# Altium schematic sheet Microcontroller.SchDoc
size D; DrawnBy: Ross Harvey; Engineer: Ross Harvey; Revision: A; SheetNumber: 3; SheetTotal: 7
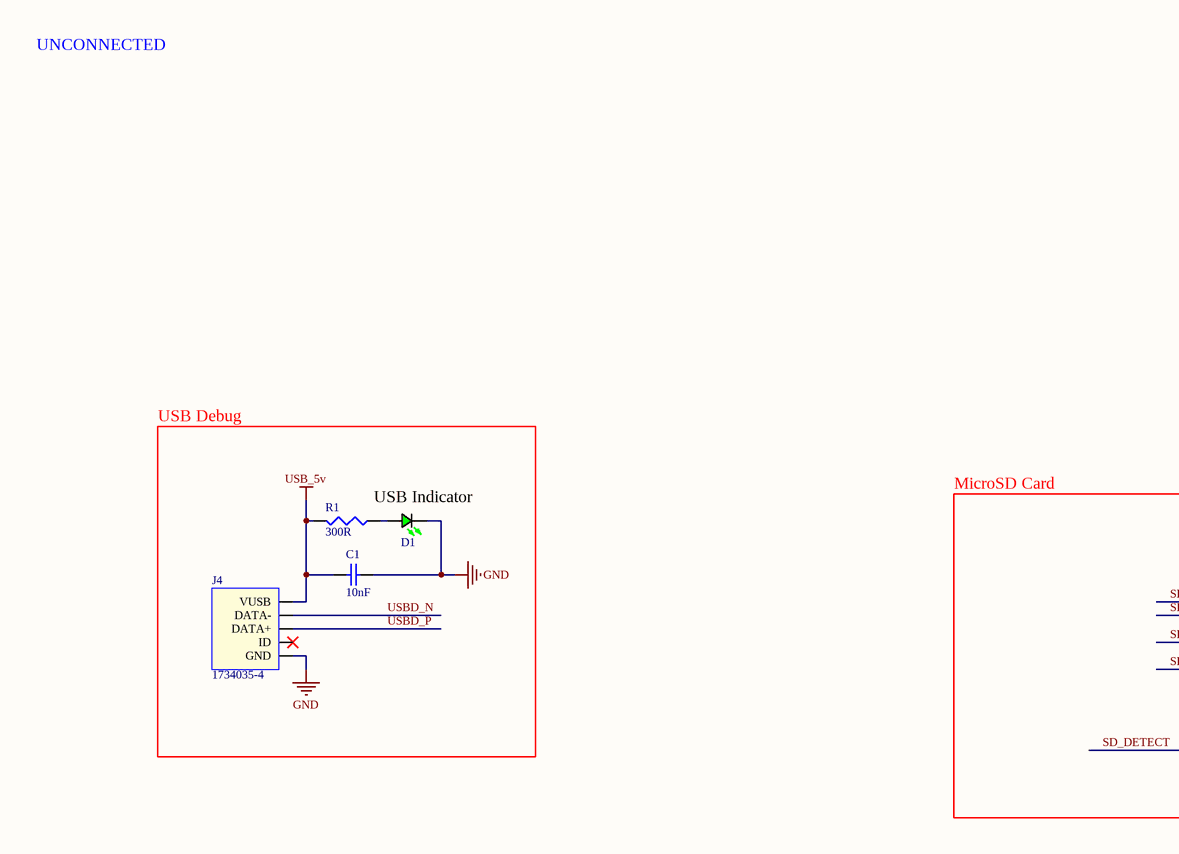
[diagram p0: Microcontroller.SchDoc, top left]
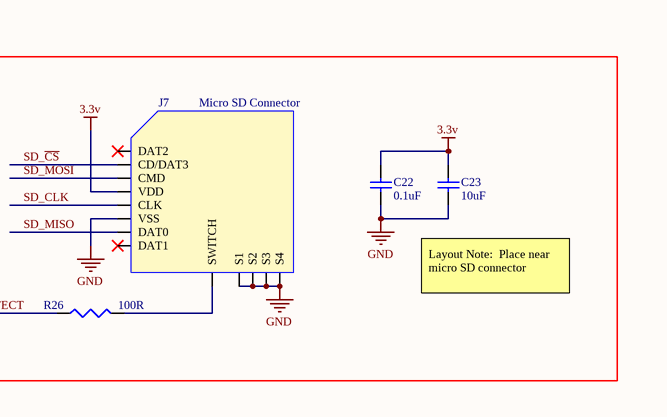
[diagram p1: Microcontroller.SchDoc, top middle]
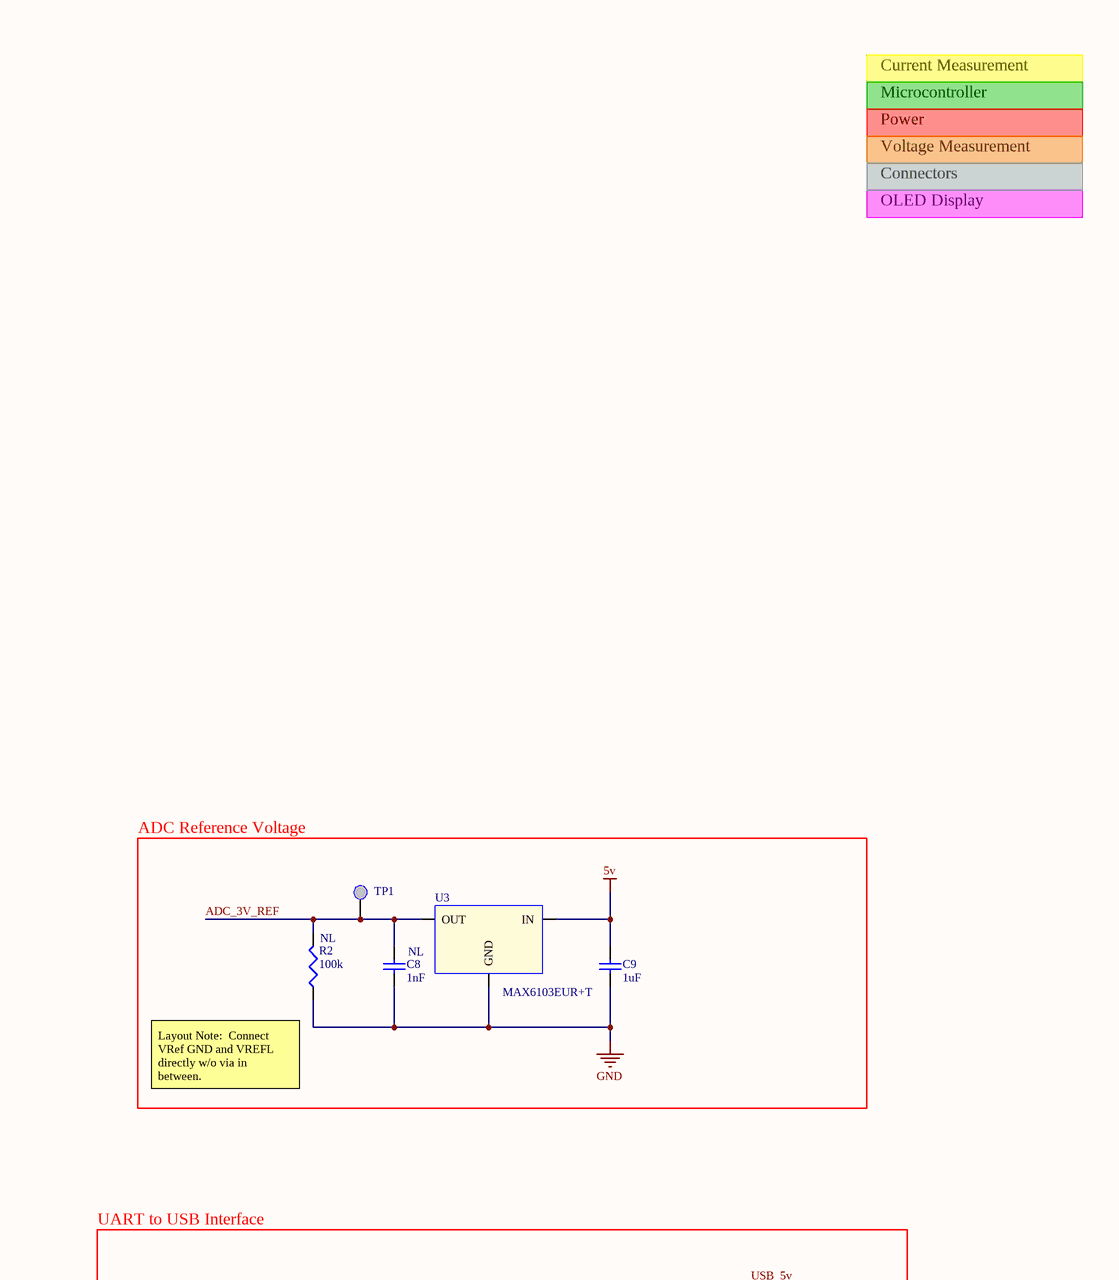
[diagram p2: Microcontroller.SchDoc, top right]
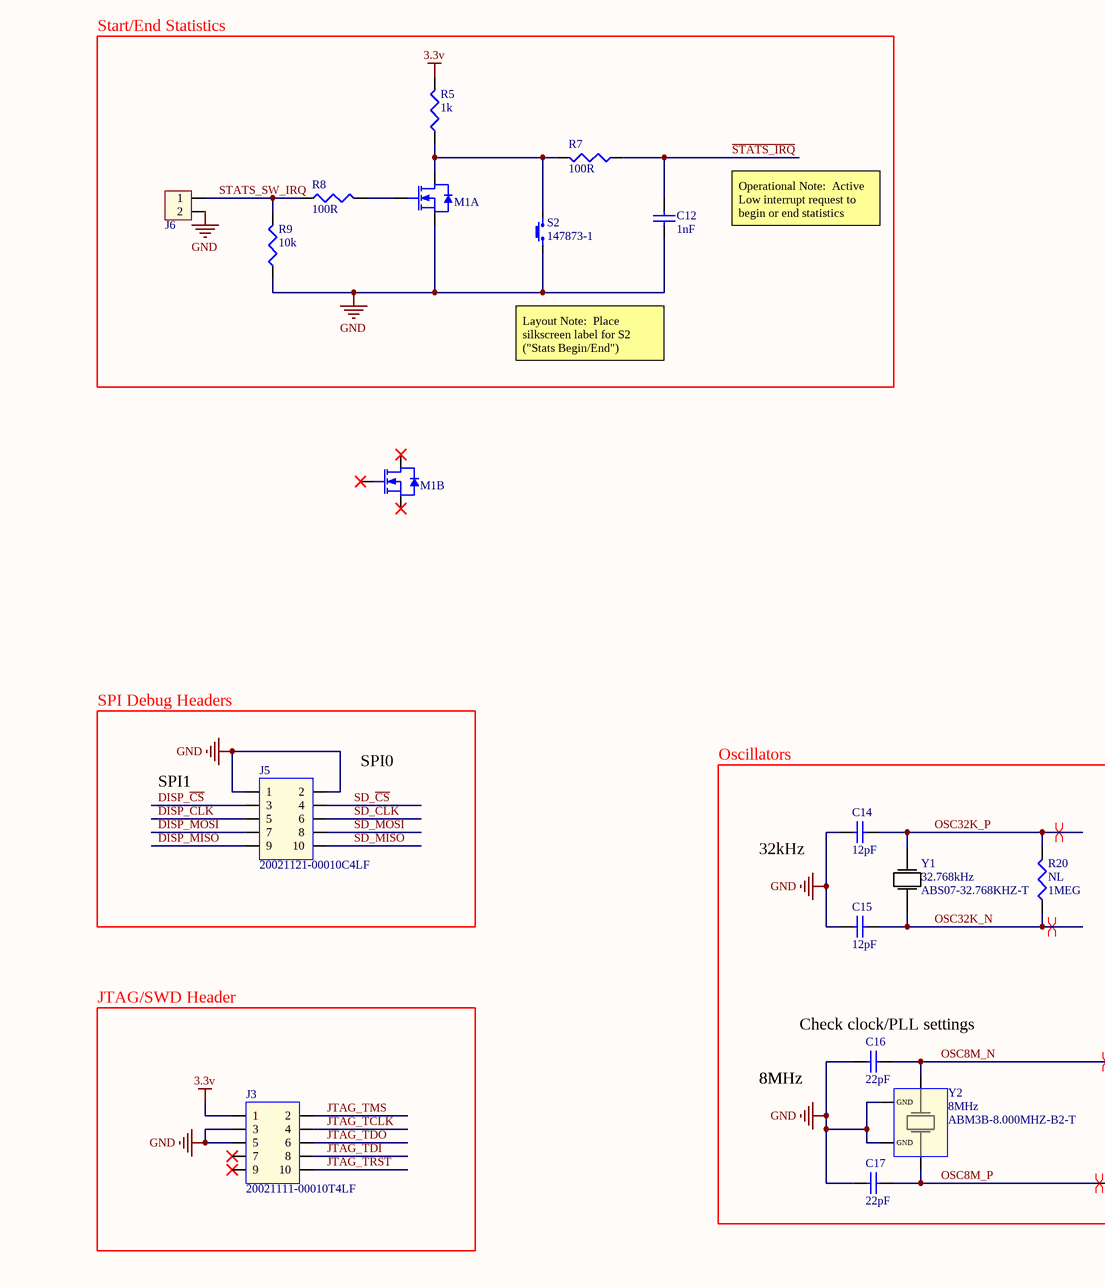
[diagram p3: Microcontroller.SchDoc, bottom left]
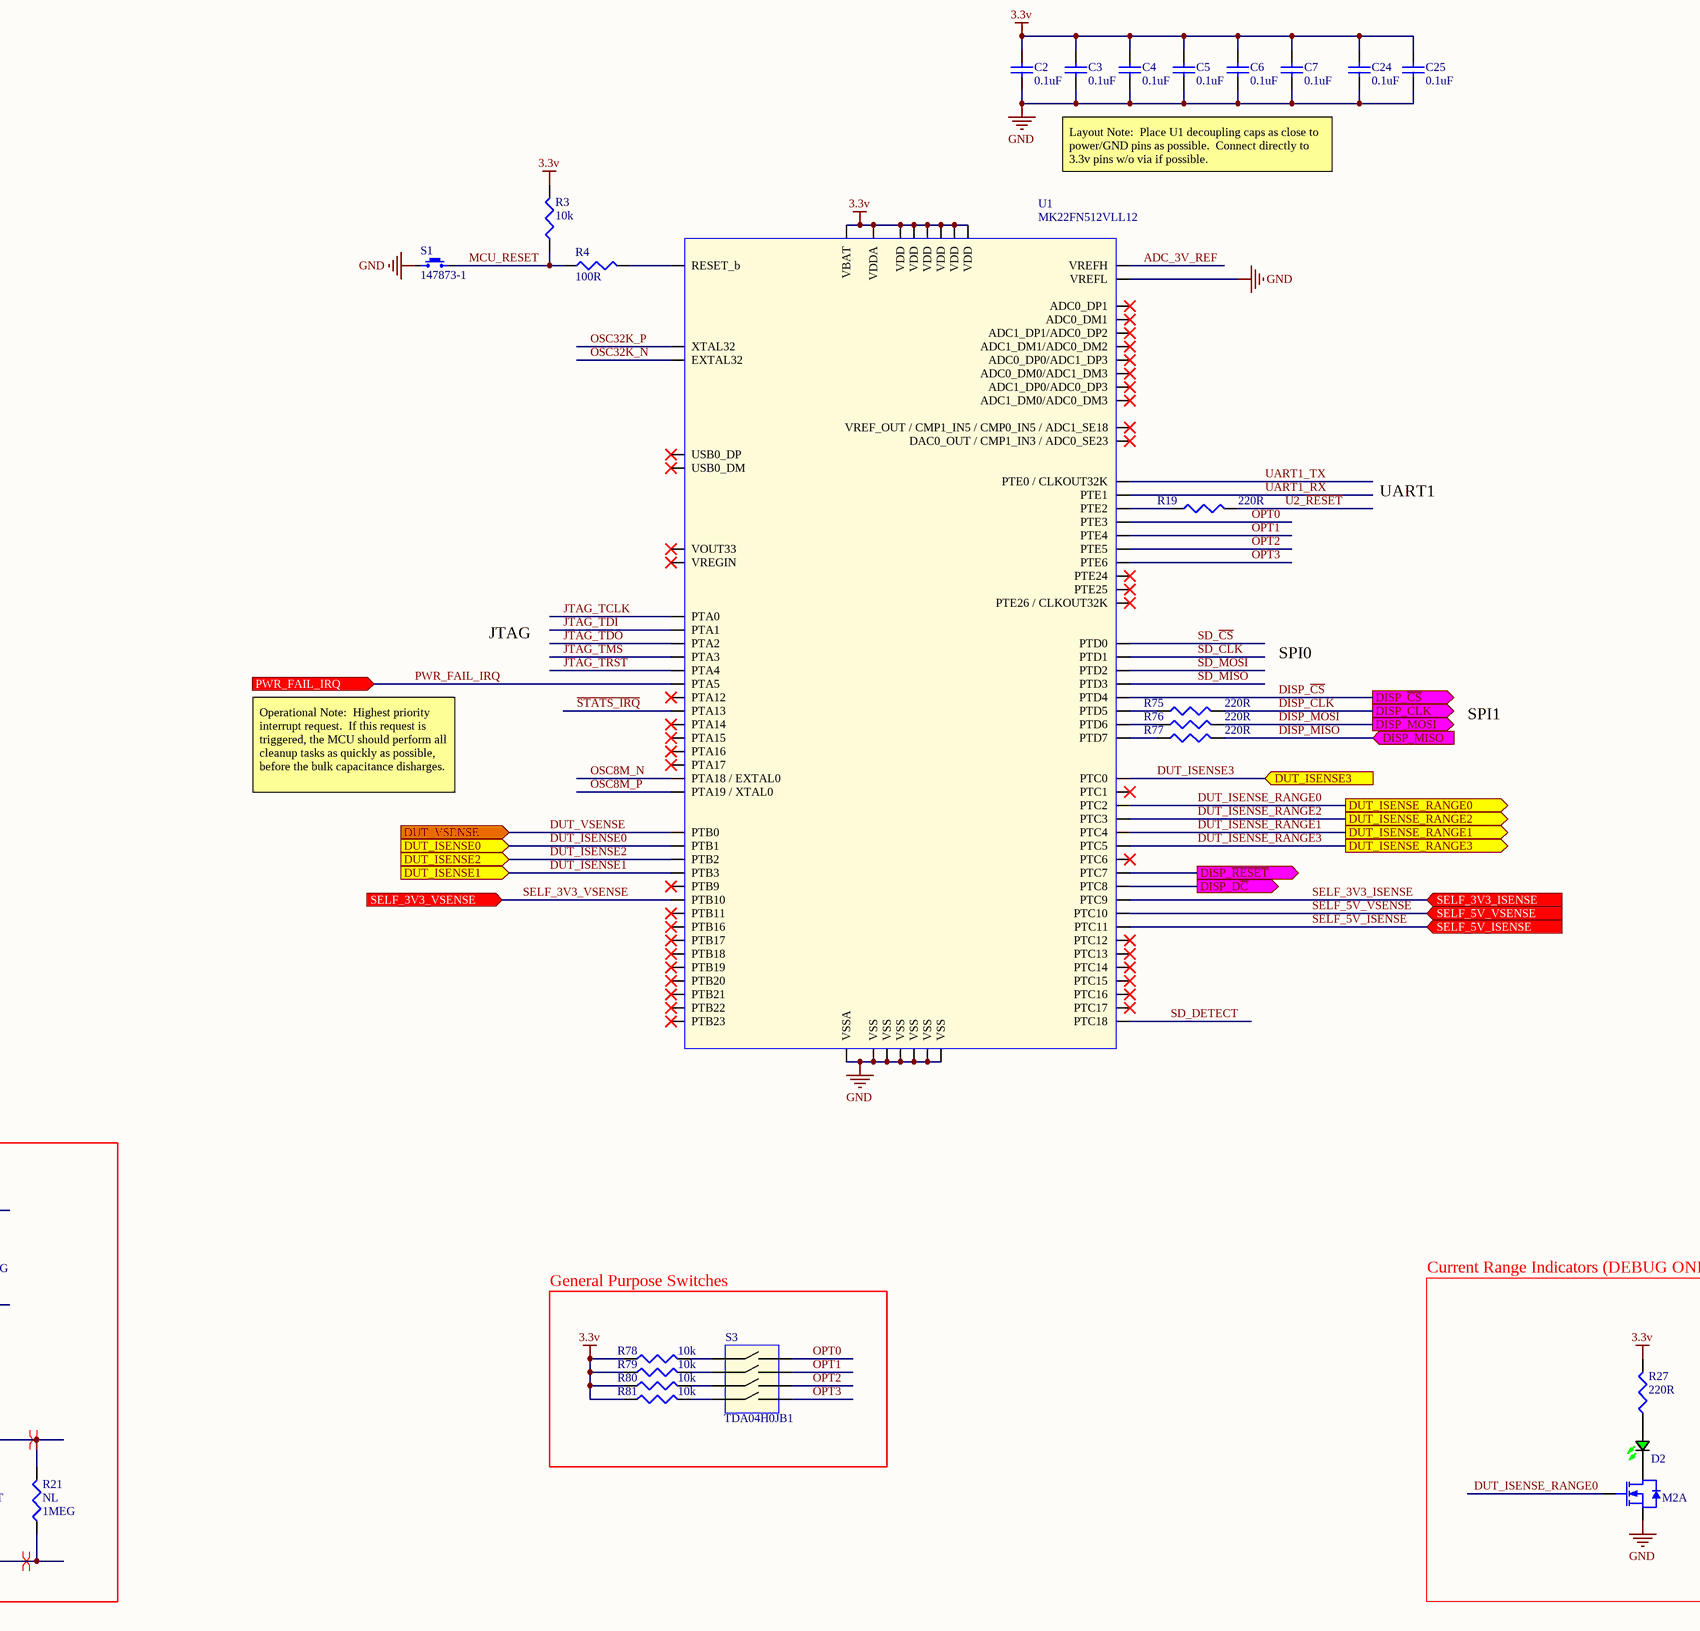
[diagram p4: Microcontroller.SchDoc, bottom middle]
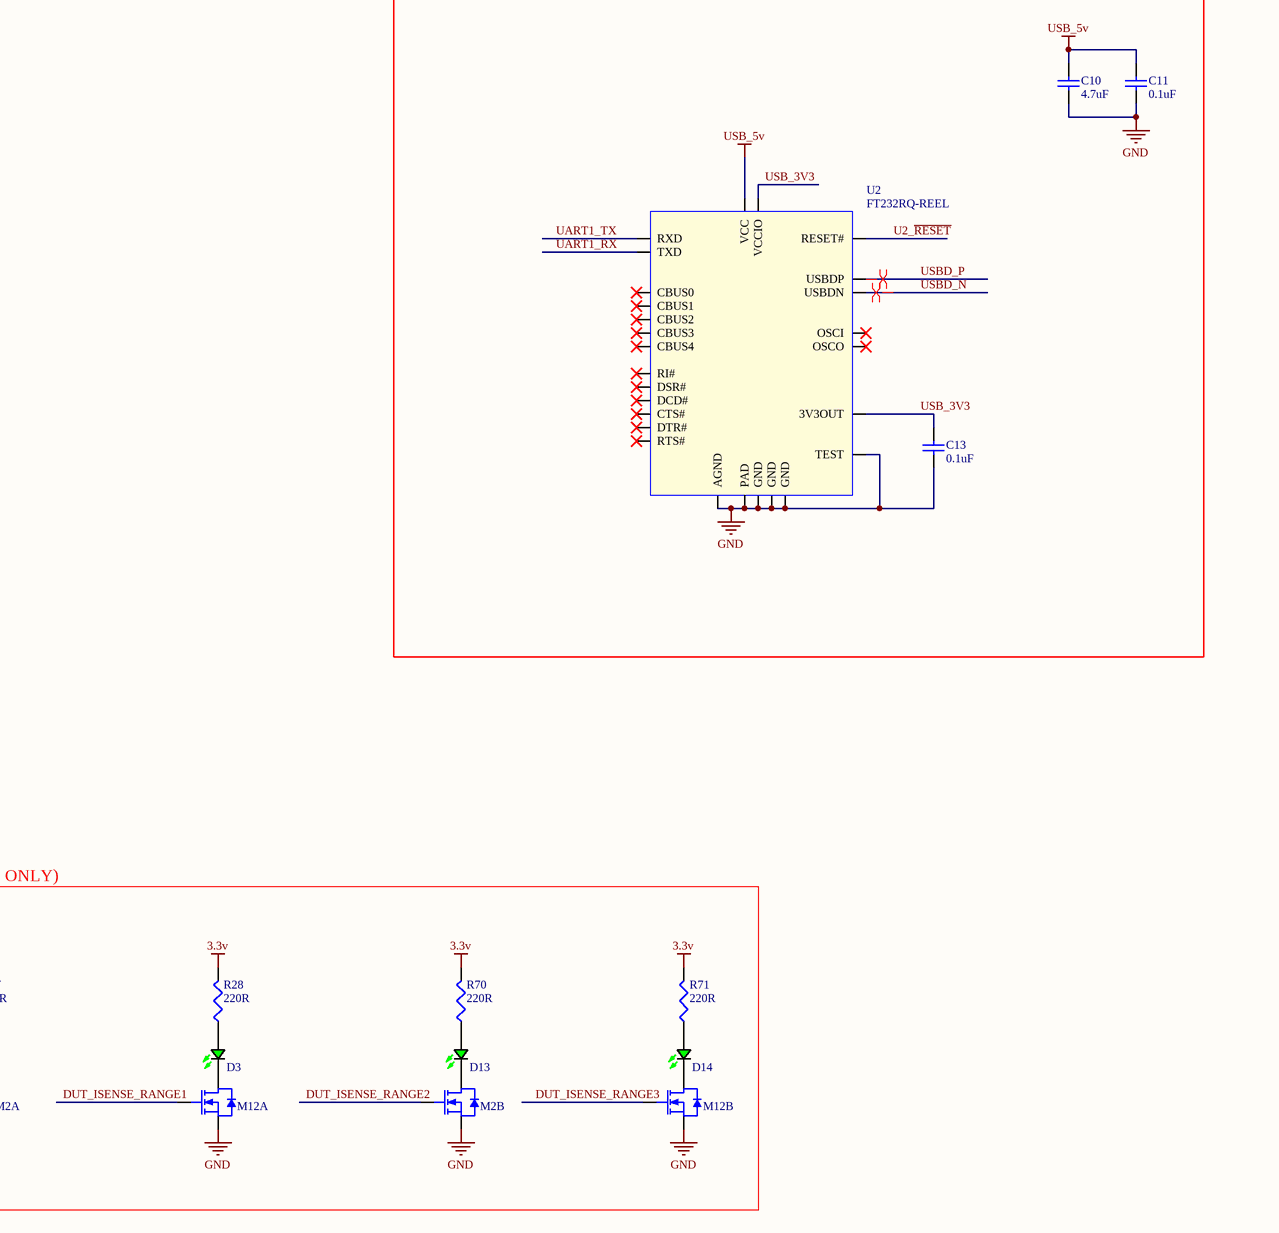
[diagram p5: Microcontroller.SchDoc, bottom right]

## Parts
C1  10nF  [CAP0402R]
C2  0.1uF  [CAP0402R]
C3  0.1uF  [CAP0402R]
C4  0.1uF  [CAP0402R]
C5  0.1uF  [CAP0402R]
C6  0.1uF  [CAP0402R]
C7  0.1uF  [CAP0402R]
C8  LOAD: NL  [CAP0402R]  (hidden comment: 1nF)
C9  1uF  [CAP0603R]
C10  4.7uF  [CAP0805R]
C11  0.1uF  [CAP0402R]
C12  1nF  [CAP0402R]
C13  0.1uF  [CAP0402R]
C14  12pF  [CAP0402R]
C15  12pF  [CAP0402R]
C16  22pF  [CAP0402R]
C17  22pF  [CAP0402R]
C22  0.1uF  [CAP0402R]
C23  10uF  [CAP1206R]
C24  0.1uF  [CAP0402R]
C25  0.1uF  [CAP0402R]
D1  LTST-S270KGKT  [LED Green 0603]  (value not drawn)
D2  LTST-S270KGKT  [LED Green 0603]  (value not drawn)
D3  LTST-S270KGKT  [LED Green 0603]  (value not drawn)
D13  LTST-S270KGKT  [LED Green 0603]  (value not drawn)
D14  LTST-S270KGKT  [LED Green 0603]  (value not drawn)
J3  20021111-00010T4LF  [2x5 Header (1.27mm)]
J4  1734035-4  [USB MINI-B 1734035-4]
J5  20021121-00010C4LF  [2x5 JTAG Header]
J6  1x2 Header  [1x2 Header]  (value not drawn)
J7  Micro SD Connector  [MICROSD_1050270001]
M1  NX3020NAKV,115  [SOT666-6N]  (value not drawn)  (parts A,B of 2)
M2  NX3020NAKV,115  [SOT666-6N]  (value not drawn)  (parts A,B of 2)
M12  NX3020NAKV,115  [SOT666-6N]  (value not drawn)  (parts A,B of 2)
R1  300R  [RES0402R]
R2  Load: NL  [RES0402R]  (hidden comment: 100k)
R3  10k  [RES0402R]
R4  100R  [RES0402R]
R5  1k  [RES0402R]
R7  100R  [RES0402R]
R8  100R  [RES0402R]
R9  10k  [RES0402R]
R19  220R  [RES0402R]
R20  Load: NL  [RES0402R]  (hidden comment: 1MEG)
R21  Load: NL  [RES0402R]  (hidden comment: 1MEG)
R26  100R  [RES0402R]
R27  220R  [RES0402R]
R28  220R  [RES0402R]
R70  220R  [RES0402R]
R71  220R  [RES0402R]
R75  220R  [RES0402R]
R76  220R  [RES0402R]
R77  220R  [RES0402R]
R78  10k  [RES0402R]
R79  10k  [RES0402R]
R80  10k  [RES0402R]
R81  10k  [RES0402R]
S1  147873-1  [TECONN_14783-1]
S2  147873-1  [TECONN_14783-1]
S3  TDA04H0JB1  [TDA04H0JB1 4xSPST]
TP1  NONE  [TESTPOINT - 1.5mm Round Pad]  (value not drawn)
U1  MK22FN512VLL12  [LQFP100 0.5mm 14mmx14mm]
U2  FT232RQ-REEL  [QFN32]
U3  MAX6103EUR+T  [SOT23-3M]
Y1  32.768kHz  [ABS07-32.768KHZ-T]
Y2  8MHz  MFG_PN: ABM3B-8.000MHZ-B2-T  [ABMM2-8.000MHZ-B2-T]

## Blocks framed on the sheet
MicroSD Card: C22 C23 J7 R26
ADC Reference Voltage: C8 C9 R2 TP1 U3
UART to USB Interface: C10 C11 C13 U2
Start/End Statistics: C12 J6 M1 R5 R7-R9 S2
General Purpose Switches: R78-R81 S3
Current Range Indicators (DEBUG ONLY): D2 D3 D13 D14 M2 M12 R27 R28 R70 R71
JTAG/SWD Header: J3

## Ports
DISP_CLK (out), DISP_D~{C} (out), DISP_MISO (in), DISP_MOSI (out), DISP_~{CS} (out), DISP_~{RESET} (out), DUT_ISENSE0 (in), DUT_ISENSE1 (in), DUT_ISENSE2 (in), DUT_ISENSE3 (in), DUT_ISENSE_RANGE0 (out), DUT_ISENSE_RANGE1 (out), DUT_ISENSE_RANGE2 (out), DUT_ISENSE_RANGE3 (out), DUT_VSENSE (in), PWR_FAIL_IRQ (in), SELF_3V3_ISENSE (in), SELF_3V3_VSENSE (in), SELF_5V_ISENSE (in), SELF_5V_VSENSE (in)

## Nets
3.3v: C2.1 C3.1 C4.1 C5.1 C6.1 C7.1 C22.1 C23.2 C24.1 C25.1 J3.1 J7.P4(VDD) R3.2 R5.2 R27.2 R28.2 R70.2 R71.2 R78.1 R79.1 R80.1 R81.1 U1.8(VDD) U1.22(VDDA) U1.30(VBAT) U1.40(VDD) U1.48(VDD) U1.61(VDD) U1.75(VDD) U1.89(VDD)
5v: C9.1 U3.1(IN)
GND: C1.2 C2.2 C3.2 C4.2 C5.2 C6.2 C7.2 C8.2 C9.2 C10.2 C11.2 C12.2 C13.1 C14.1 C15.1 C16.1 C17.1 C22.2 C23.1 C24.2 C25.2 D1.1(K) J3.3 J3.5 J4.5(GND) J4.SH1 J4.SH2 J4.SH3 J4.SH4 J5.1 J5.2 J6.2 J7.P6(VSS) J7.S1 J7.S2 J7.S3 J7.S4 M1.1(S1) M2.1(S1) M2.4(S2) M12.1(S1) M12.4(S2) R2.1 R9.1 S1.1 S2.1 U1.9(VSS) U1.24(VREFL) U1.25(VSSA) U1.41(VSS) U1.49(VSS) U1.60(VSS) U1.74(VSS) U1.88(VSS) U2.0(PAD) U2.4(GND) U2.17(GND) U2.20(GND) U2.24(AGND) U2.26(TEST) U3.3(GND) Y2.1(GND) Y2.3(GND)
USB_5v: C1.1 C10.1 C11.1 J4.1(VUSB) R1.2 U2.19(VCC)
ADC_3V_REF: C8.1 R2.2 TP1.1 U1.23(VREFH) U3.2(OUT)
DISP_~{CS}: J5.3 U1.97(PTD4) ; port DISP_~{CS}
DISP_CLK: J5.5 R75.2 ; port DISP_CLK
DISP_D~{C}: U1.80(PTC8) ; port DISP_D~{C}
DISP_MISO: J5.9 R77.2 ; port DISP_MISO
DISP_MOSI: J5.7 R76.2 ; port DISP_MOSI
DISP_~{RESET}: U1.79(PTC7) ; port DISP_~{RESET}
DUT_ISENSE0: U1.54(PTB1) ; port DUT_ISENSE0
DUT_ISENSE1: U1.56(PTB3) ; port DUT_ISENSE1
DUT_ISENSE2: U1.55(PTB2) ; port DUT_ISENSE2
DUT_ISENSE3: U1.70(PTC0) ; port DUT_ISENSE3
DUT_ISENSE_RANGE0: M2.2(G1) U1.72(PTC2) ; port DUT_ISENSE_RANGE0
DUT_ISENSE_RANGE1: M12.2(G1) U1.76(PTC4) ; port DUT_ISENSE_RANGE1
DUT_ISENSE_RANGE2: M2.5(G2) U1.73(PTC3) ; port DUT_ISENSE_RANGE2
DUT_ISENSE_RANGE3: M12.5(G2) U1.77(PTC5) ; port DUT_ISENSE_RANGE3
DUT_VSENSE: U1.53(PTB0) ; port DUT_VSENSE
JTAG_TCLK: J3.4 U1.34(PTA0)
JTAG_TDI: J3.8 U1.35(PTA1)
JTAG_TDO: J3.6 U1.36(PTA2)
JTAG_TMS: J3.2 U1.37(PTA3)
JTAG_TRST: J3.10 U1.38(PTA4)
MCU_RESET: R3.1 R4.1 S1.2
OPT0: S3.8 U1.4(PTE3)
OPT1: S3.7 U1.5(PTE4)
OPT2: S3.6 U1.6(PTE5)
OPT3: S3.5 U1.7(PTE6)
OSC8M_N: C16.2 R21.2 U1.50(PTA18_/_EXTAL0) Y2.2
OSC8M_P: C17.2 R21.1 U1.51(PTA19_/_XTAL0) Y2.4
OSC32K_N: C15.2 R20.1 U1.29(EXTAL32) Y1.1
OSC32K_P: C14.2 R20.2 U1.28(XTAL32) Y1.2
PWR_FAIL_IRQ: U1.39(PTA5) ; port PWR_FAIL_IRQ
~{STATS_IRQ}: C12.1 R7.1 U1.43(PTA13)
SD_~{CS}: J5.4 J7.P2(CD/DAT3) U1.93(PTD0)
SD_CLK: J5.6 J7.P5(CLK) U1.94(PTD1)
SD_DETECT: R26.1 U1.92(PTC18)
SD_MISO: J5.10 J7.P7(DAT0) U1.96(PTD3)
SD_MOSI: J5.8 J7.P3(CMD) U1.95(PTD2)
SELF_3V3_ISENSE: U1.81(PTC9) ; port SELF_3V3_ISENSE
SELF_3V3_VSENSE: U1.58(PTB10) ; port SELF_3V3_VSENSE
SELF_5V_ISENSE: U1.83(PTC11) ; port SELF_5V_ISENSE
SELF_5V_VSENSE: U1.82(PTC10) ; port SELF_5V_VSENSE
STATS_SW_IRQ: J6.1 R8.1 R9.2
U2_~{RESET}: R19.2 U2.18(RESET#)
UART1_RX: U1.2(PTE1) U2.30(TXD)
UART1_TX: U1.1(PTE0_/_CLKOUT32K) U2.2(RXD)
USB_3V3: C13.2 U2.1(VCCIO) U2.16(3V3OUT)
USBD_N: J4.2(DATA-) U2.15(USBDN)
USBD_P: J4.3(DATA+) U2.14(USBDP)
NetD1_2: D1.2(A) R1.1
NetD2_1: D2.1(K) M2.6(D1)
NetD2_2: D2.2(A) R27.1
NetD3_1: D3.1(K) M12.6(D1)
NetD3_2: D3.2(A) R28.1
NetD13_1: D13.1(K) M2.3(D2)
NetD13_2: D13.2(A) R70.1
NetD14_1: D14.1(K) M12.3(D2)
NetD14_2: D14.2(A) R71.1
NetJ7_G1: J7.G1(SWITCH) R26.2
NetM1_2: M1.2(G1) R8.2
NetM1_6: M1.6(D1) R5.1 R7.2 S2.2
NetR4_2: R4.2 U1.52(RESET_b)
NetR19_1: R19.1 U1.3(PTE2)
NetR75_1: R75.1 U1.98(PTD5)
NetR76_1: R76.1 U1.99(PTD6)
NetR77_1: R77.1 U1.100(PTD7)
NetR78_2: R78.2 S3.1
NetR79_2: R79.2 S3.2
NetR80_2: R80.2 S3.3
NetR81_2: R81.2 S3.4

Not connected (* = marked no-connect by the designer): J3 7* 9*; J4 4(ID)*; J7 P1(DAT2)* P8(DAT1)*; M1 3(D2)* 4(S2)* 5(G2)*; U1 10(USB0_DP)* 11(USB0_DM)* 12(VOUT33)* 13(VREGIN)* 14(ADC0_DP1)* 15(ADC0_DM1)* 16(ADC1_DP1/ADC0_DP2)* 17(ADC1_DM1/ADC0_DM2)* 18(ADC0_DP0/ADC1_DP3)* 19(ADC0_DM0/ADC1_DM3)* 20(ADC1_DP0/ADC0_DP3)* 21(ADC1_DM0/ADC0_DM3)* 26(VREF_OUT_/_CMP1_IN5_/_CMP0_IN5_/_ADC1_SE18)* 27(DAC0_OUT_/_CMP1_IN3_/_ADC0_SE23)* 31(PTE24)* 32(PTE25)* 33(PTE26_/_CLKOUT32K)* 42(PTA12)* 44(PTA14)* 45(PTA15)* 46(PTA16)* 47(PTA17)* 57(PTB9)* 59(PTB11)* 62(PTB16)* 63(PTB17)* 64(PTB18)* 65(PTB19)* 66(PTB20)* 67(PTB21)* 68(PTB22)* 69(PTB23)* 71(PTC1)* 78(PTC6)* 84(PTC12)* 85(PTC13)* 86(PTC14)* 87(PTC15)* 90(PTC16)* 91(PTC17)*; U2 3(RI#)* 5(NC) 6(DSR#)* 7(DCD#)* 8(CTS#)* 9(CBUS4)* 10(CBUS2)* 11(CBUS3)* 12(NC) 13(NC) 21(CBUS1)* 22(CBUS0)* 23(NC) 25(NC) 27(OSCI)* 28(OSCO)* 29(NC) 31(DTR#)* 32(RTS#)*

## Layout directives
differential pair: OSC8M_N, OSC8M_P, OSC32K_N, OSC32K_P, USBD_N, USBD_P

## Notes on the sheet
- UNCONNECTED
- Current Measurement
- Microcontroller
- Power
- Voltage Measurement
- Connectors
- OLED Display
- USB Debug
- USB Indicator
- Layout Note:  Place near micro SD connector
- Layout Note:  Place U1 decoupling caps as close to power/GND pins as possible.  Connect directly to 3.3v pins w/o via if possible.
- (near R2) Layout Note:  Connect VRef GND and VREFL directly w/o via in between.
- UART1
- Operational Note:  Active Low interrupt request to begin or end statistics
- JTAG
- SPI0
- Layout Note:  Place silkscreen label for S2 ("Stats Begin/End")
- SPI1
- Operational Note:  Highest priority interrupt request.  If this request is triggered, the MCU should perform all cleanup tasks as quickly as possible, before the bulk capacitance disharges.
- SPI Debug Headers
- (near J5) SPI0
- Oscillators
- (near C14) 32kHz
- (near C16) Check clock/PLL settings
- 8MHz

## Library data of the parts
C1 = 10nF (0402): Tolerance: 5%; MFG_PN: VJ0402Y103JXXAC; MFG: Vishay; Voltage: 25v; LOAD: NL; Value: 10nF
C2-C7 C11 C13 C22 C24 C25 = 0.1uF (0402): Tolerance: 20%; MFG_PN: VJ0402G104MXQCW1BC; MFG: Vishay; Voltage: 10v; LOAD: NL; Value: 0.1uF
C8 = 1nF (0402): Tolerance: 10%; MFG_PN: VJ0402Y102KXAAC; MFG: Vishay; Voltage: 50v; Value: 1nF
C9 = 1uF: MFG_PN: VJ0805V105ZXXTW1BC; MFG: Vishay; Voltage: 25v; LOAD: NL; Value: 1uF
C10 = 4.7uF (0805): MFG_PN: VJ0805V475MXQTW1BC; MFG: Vishay; Voltage: 10v; LOAD: NL; Value: 4.7uF
C12 = 1nF (0402): Tolerance: 10%; MFG_PN: VJ0402Y102KXAAC; MFG: Vishay; Voltage: 50v; LOAD: NL; Value: 1nF
C14 C15 = 12pF (0402): Tolerance: 5%; MFG_PN: GRM1555C1H120JA01D; MFG: Murata; Voltage: 50v; LOAD: NL; Value: 12pF
C16 C17 = 22pF (0402): Tolerance: 5%; MFG_PN: 04025A220JAT2A; MFG: AVX; Voltage: 50v; LOAD: NL; Value: 22pF
C23 = 10uF: MFG1_PN: VJ1206V106ZXQTW1BC; MFG1: Vishay; Voltage: 10v; Value: 10uF
D1-D3 D13 D14 = LED Green 0603: MFG: Lite On; VFORWARD: 2v; CURRENT: 20mA; COLOR: Green; MFG_PN: LTST-S270KGKT
J3 = 2x5 JTAG Header TH: 2x5 JTAG Header TH (1.27mm); LOAD: NL; MFG: FCI; CURRENT: 1A; MFG_PN: 20021111-00010T4LF
J4 = USB Mini-B Female: USB Mini B Female; MFG: TE CONNECTIVITY; CONTACTS: 5; LOAD: NL; MFG_PN: 1734035-4; TYPE: USB Mini B; GENDER: FEMALE
J5 = 2x5 JTAG Header SMD: 2x5 JTAG Header SMD (1.27mm); LOAD: NL; MFG: FCI; CURRENT: 1A; MFG_PN: 20021121-00010C4LF
J6 = 1x2 Header: 1x2 Header, 2.52mm pitch
J7 = MICRO_SD 1050270001: LOAD: NL; MFG: MOLEX; MFG_PN: 1050270001
M1 M2 M12 = NX3020NAKV: NFET_DUAL_200mA_30v; LOAD: NL; MFG: NXP; VDS_MAX: 30v; I_MAX: 200mA; P_MAX: 1.1W; RDS_ON: 2.7; VGS_MAX: *; MFG_PN: NX3020NAKV,115
R1 = 300R (0402): Tolerance: 1%; POWER: 63mW; MFG_PN: CRCW0402300RFKED; MFG: Vishay; Load: NL; Value: 300R
R2 = 100k (0402): Tolerance: 1%; POWER: 63mW; MFG_PN: CRCW0402100KFKED; MFG: Vishay; Value: 100k
R3 R9 R78-R81 = 10k (0402): Tolerance: 1%; POWER: 63mW; MFG_PN: CRCW040210K0FKED; MFG: Vishay; Load: NL; Value: 10k
R4 R7 R8 R26 = 100R (0402): Tolerance: 1%; POWER: 63mW; MFG_PN: CRCW0402100RFKED; MFG: Vishay; Load: NL; Value: 100R
R5 = 1k (0402): Tolerance: 1%; POWER: 63mW; MFG_PN: CRCW04021K00FKED; MFG: Vishay; Load: NL; Value: 1k
R19 R27 R28 R70 R71 R75-R77 = 220R (0402): Tolerance: 1%; POWER: 63mW; MFG_PN: CRCW0402220RFKED; MFG: Vishay; Load: NL; Value: 220R
R20 R21 = 1MEG (0402): Tolerance: 1%; POWER: 63mW; MFG_PN: CRCW04021M00FKED; MFG: Vishay; Value: 1MEG
S1 S2 = SPST Momentary Micro: Micro SPST Momentary Switch; MFG: TE CONNECTIVITY; LOAD: NL; CURRENT: 50mA; VOLTAGE: 24v; MFG_PN: 147873-1
S3 = 4xSPST Microswitch (1.27mm): SPST Microswitch Array (4 Position); LOAD: NL; MFG: C&K; MFG_PN: TDA04H0JB1
TP1 = Testpoint 1.5mm SMD: 1.5mm Testpoint
U1 = MK22FN512VLL12: 32-bit ARM Cortex-M4 Microcontroller; MFG: FREESCALE; MFG_PN: MK22FN512VLL12
U2 = FT232RQ-REEL: UART Interface/Bridge; MFG: FTDI; MFG_PN: FT232RQ-REEL
U3 = MAX6103EUR+T: Precision 3v Reference; MFG: MAXIM; ACCURACY: 0.4%; LOAD: NL; MFG_PN: MAX6103EUR+T; VOUT: 3v
Y1 = 32kHz Crystal: MFG: ABRACON; CLOAD: 12.5pF; FREQ: 32.768kHz; MFG_PN: ABS07-32.768KHZ-T
Y2 = 8.0MHz Crystal 18pF 20ppm: 8.0MHz Crystal; MFG: ABRACON; CLOAD: 18pF; FREQ: 8MHz